# EAGLE design mcb_mini43 (EAGLE 5.11)
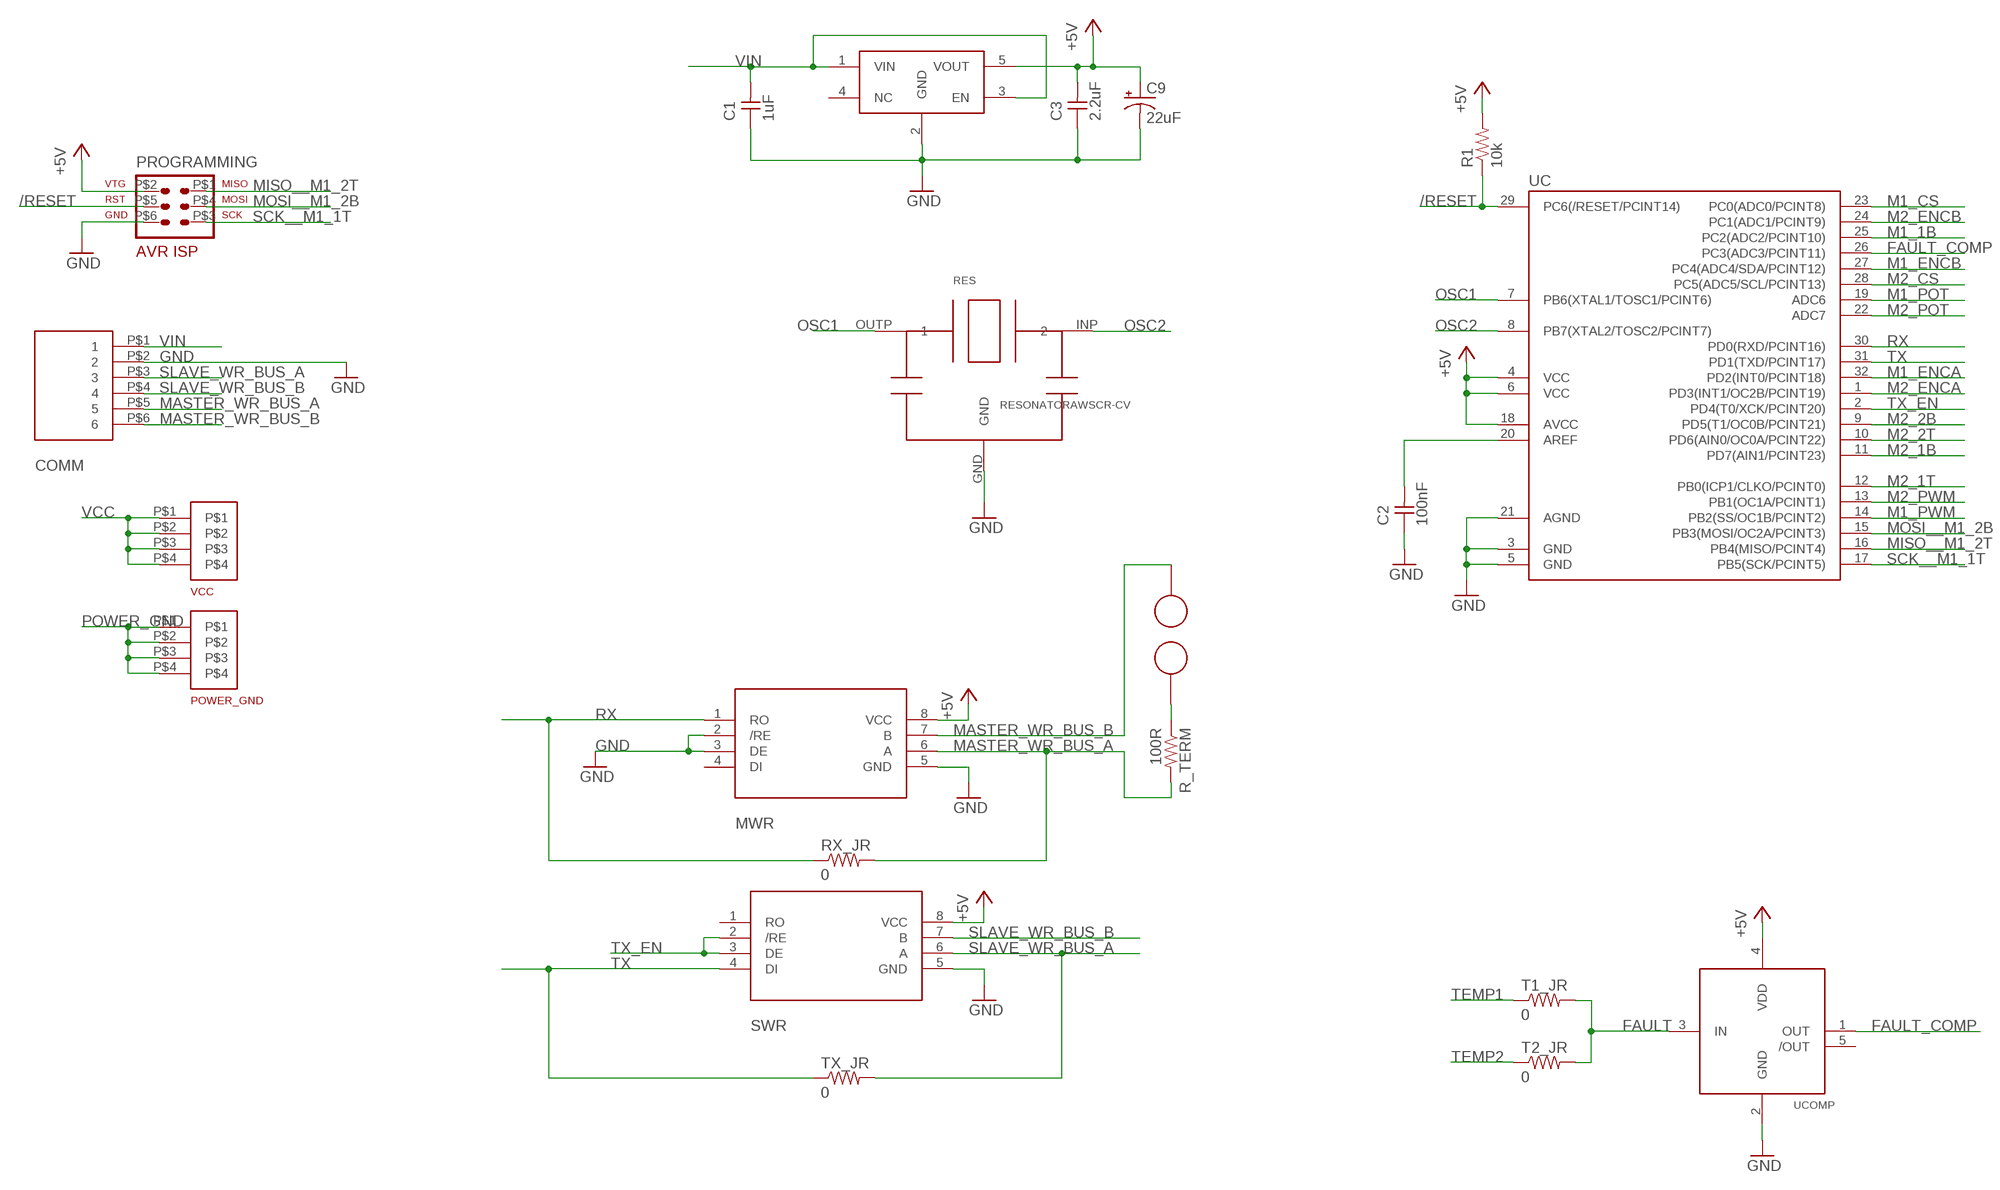
[diagram p0: schematic, sheet 1, part 1 of 2]
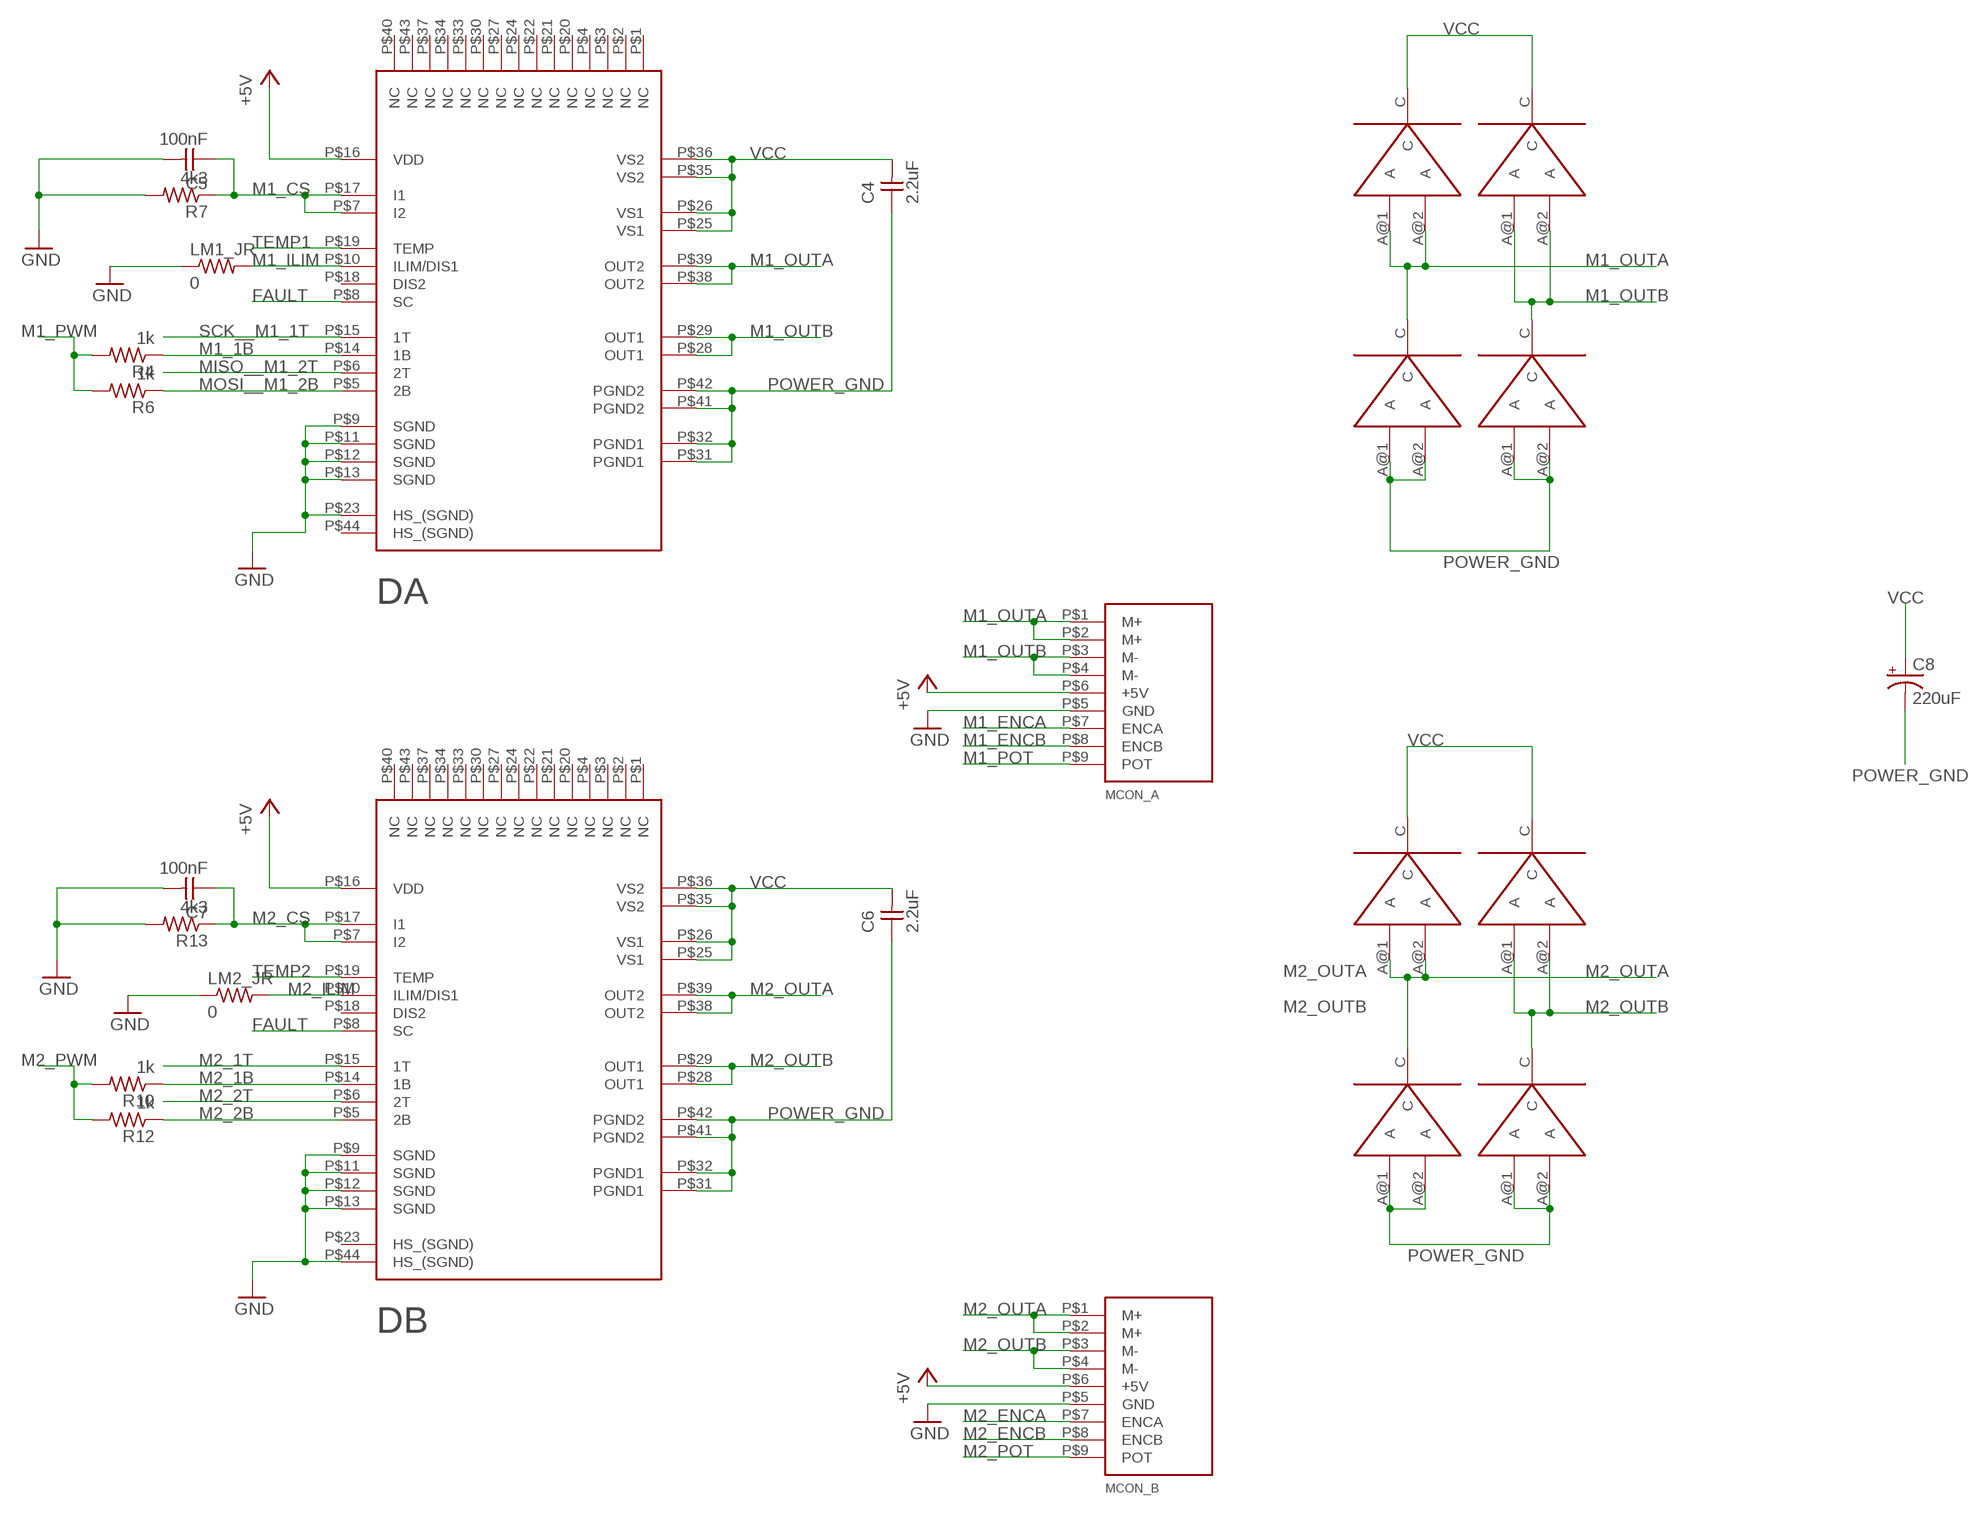
[diagram p1: schematic, sheet 1, part 2 of 2]

## Parts
C1  1uF  CAPACITOR0805  [0805]
C2  100nF  CAPACITOR0805  [0805]
C3  2.2uF  CAPACITOR0805  [0805]
C4  2.2uF  CAPACITOR0805  [0805]
C5  100nF  CAPACITOR0805  [0805]
C6  2.2uF  CAPACITOR0805  [0805]
C7  100nF  CAPACITOR0805  [0805]
C8  220uF  ASM-AXIAL-CAP  [ASM_AXIAL_CAP]
C9  22uF  CAPACITOR-POL-VS  [CAP-POLAR-VS]
COMM  6PIN-RIBBONCABLE-BOARDHEADER  [6PIN-HEADER-DUALROW]
D1  DIODE-POWERMITE  [POWERMITE3]
D2  DIODE-POWERMITE  [POWERMITE3]
D3  DIODE-POWERMITE  [POWERMITE3]
D4  DIODE-POWERMITE  [POWERMITE3]
D5  DIODE-POWERMITE  [POWERMITE3]
D6  DIODE-POWERMITE  [POWERMITE3]
D7  DIODE-POWERMITE  [POWERMITE3]
D8  DIODE-POWERMITE  [POWERMITE3]
DA  APEX-SAS5A757A  [44-HSOP]
DB  APEX-SAS5A757A  [44-HSOP]
LM1_JR  0  RESISTOR0603  [0603]
LM2_JR  0  RESISTOR0603  [0603]
MCON_A  9-PIN-MOTOR_CONNECTOR  [9-PIN-2.54MM-TERMINAL-BLOCK]
MCON_B  9-PIN-MOTOR_CONNECTOR  [9-PIN-2.54MM-TERMINAL-BLOCK]
MWR  ADM4857ARZ  [SOIC8]
POWER_GND  SCREW_TERMINAL_7700K  [SCREW_TERM_7700K]
PROGRAMMING  AVR-ISP-6SURFACE_MOUNT  [SMD6]
R1  10k  RESISTOR0603  [0603]
R4  1k  RESISTOR0603  [0603]
R6  1k  RESISTOR0603  [0603]
R7  4k3  RESISTOR0603  [0603]
R10  1k  RESISTOR0603  [0603]
R12  1k  RESISTOR0603  [0603]
R13  4k3  RESISTOR0603  [0603]
R_TERM  100R  RESISTOR0805  [0805]
RES  RESONATORAWSCR-CV  [AWSCR-CV]
RTERM1  CONNECTOR_TV  [CONNECTOR_TV]
RTERM2  CONNECTOR_TV  [CONNECTOR_TV]
RX_JR  0  RESISTOR0603  [0603]
SWR  ADM4857ARZ  [SOIC8]
T1_JR  0  RESISTOR0603  [0603]
T2_JR  0  RESISTOR0603  [0603]
TX_JR  0  RESISTOR0603  [0603]
UC  MEGA48/88/168-AU  [TQFP32-08]
UCOMP  ADCMP361  [SOT-23-5]
VCC  SCREW_TERMINAL_7700K  [SCREW_TERM_7700K]
VREG  MIC5235  [SOT-23-5]

## Nets
+1.1V: C2.2 UC.20(AREF)
+5V: C3.2 C9.+ DA.P$16(VDD) DB.P$16(VDD) MCON_A.P$6(+5V) MCON_B.P$6(+5V) MWR.8(VCC) PROGRAMMING.P$2 R1.2 SWR.8(VCC) UC.4(VCC) UC.6(VCC) UC.18(AVCC) UCOMP.4(VDD) VREG.5(VOUT)
/RESET: PROGRAMMING.P$5 R1.1 UC.29(PC6(/RESET/PCINT14))
FAULT: DA.P$8(SC) DB.P$8(SC) T1_JR.2 T2_JR.2 UCOMP.3(IN)
FAULT_COMP: UC.26(PC3(ADC3/PCINT11)) UCOMP.1(OUT)
GND: C1.1 C2.1 C3.1 C5.2 C7.2 C9.- COMM.P$2 DA.P$9(SGND) DA.P$11(SGND) DA.P$12(SGND) DA.P$13(SGND) DA.P$23(HS_(SGND)) DB.P$9(SGND) DB.P$11(SGND) DB.P$12(SGND) DB.P$13(SGND) DB.P$44(HS_(SGND)) LM1_JR.1 LM2_JR.1 MCON_A.P$5(GND) MCON_B.P$5(GND) MWR.2(/RE) MWR.3(DE) MWR.5(GND) PROGRAMMING.P$6 R7.2 R13.2 RES.GND SWR.5(GND) UC.3(GND) UC.5(GND) UC.21(AGND) UCOMP.2(GND) VREG.2(GND)
M1_1B: DA.P$14(1B) R4.1 UC.25(PC2(ADC2/PCINT10))
M1_CS: C5.1 DA.P$7(I2) DA.P$17(I1) R7.1 UC.23(PC0(ADC0/PCINT8))
M1_ENCA: MCON_A.P$7(ENCA) UC.32(PD2(INT0/PCINT18))
M1_ENCB: MCON_A.P$8(ENCB) UC.27(PC4(ADC4/SDA/PCINT12))
M1_ILIM: DA.P$10(ILIM/DIS1) LM1_JR.2
M1_OUTA: D1.A@1(A) D1.A@2(A) D3.C DA.P$38(OUT2) DA.P$39(OUT2) MCON_A.P$1(M+) MCON_A.P$2(M+)
M1_OUTB: D2.A@1(A) D2.A@2(A) D4.C DA.P$28(OUT1) DA.P$29(OUT1) MCON_A.P$3(M-) MCON_A.P$4(M-)
M1_POT: MCON_A.P$9(POT) UC.19(ADC6)
M1_PWM: R4.2 R6.2 UC.14(PB2(SS/OC1B/PCINT2))
M2_1B: DB.P$14(1B) R10.1 UC.11(PD7(AIN1/PCINT23))
M2_1T: DB.P$15(1T) UC.12(PB0(ICP1/CLKO/PCINT0))
M2_2B: DB.P$5(2B) R12.1 UC.9(PD5(T1/OC0B/PCINT21))
M2_2T: DB.P$6(2T) UC.10(PD6(AIN0/OC0A/PCINT22))
M2_CS: C7.1 DB.P$7(I2) DB.P$17(I1) R13.1 UC.28(PC5(ADC5/SCL/PCINT13))
M2_ENCA: MCON_B.P$7(ENCA) UC.1(PD3(INT1/OC2B/PCINT19))
M2_ENCB: MCON_B.P$8(ENCB) UC.24(PC1(ADC1/PCINT9))
M2_ILIM: DB.P$10(ILIM/DIS1) LM2_JR.2
M2_OUTA: D5.A@1(A) D5.A@2(A) D7.C DB.P$38(OUT2) DB.P$39(OUT2) MCON_B.P$1(M+) MCON_B.P$2(M+)
M2_OUTB: D6.A@1(A) D6.A@2(A) D8.C DB.P$28(OUT1) DB.P$29(OUT1) MCON_B.P$3(M-) MCON_B.P$4(M-)
M2_POT: MCON_B.P$9(POT) UC.22(ADC7)
M2_PWM: R10.2 R12.2 UC.13(PB1(OC1A/PCINT1))
MASTER_WR_BUS_A: COMM.P$5 MWR.6(A) R_TERM.2 RX_JR.2
MASTER_WR_BUS_B: COMM.P$6 MWR.7(B) RTERM1.P$1
MISO__M1_2T: DA.P$6(2T) PROGRAMMING.P$1 UC.16(PB4(MISO/PCINT4))
MOSI__M1_2B: DA.P$5(2B) PROGRAMMING.P$4 R6.1 UC.15(PB3(MOSI/OC2A/PCINT3))
N$1: R_TERM.1 RTERM2.P$1
OSC1: RES.OUTP UC.7(PB6(XTAL1/TOSC1/PCINT6))
OSC2: RES.INP UC.8(PB7(XTAL2/TOSC2/PCINT7))
POWER_GND: C4.1 C6.1 C8.- D3.A@1(A) D3.A@2(A) D4.A@1(A) D4.A@2(A) D7.A@1(A) D7.A@2(A) D8.A@1(A) D8.A@2(A) DA.P$31(PGND1) DA.P$32(PGND1) DA.P$41(PGND2) DA.P$42(PGND2) DB.P$31(PGND1) DB.P$32(PGND1) DB.P$41(PGND2) DB.P$42(PGND2) POWER_GND.P$1 POWER_GND.P$2 POWER_GND.P$3 POWER_GND.P$4
RX: MWR.1(RO) RX_JR.1 UC.30(PD0(RXD/PCINT16))
SCK__M1_1T: DA.P$15(1T) PROGRAMMING.P$3 UC.17(PB5(SCK/PCINT5))
SLAVE_WR_BUS_A: COMM.P$3 SWR.6(A) TX_JR.2
SLAVE_WR_BUS_B: COMM.P$4 SWR.7(B)
TEMP1: DA.P$19(TEMP) T1_JR.1
TEMP2: DB.P$19(TEMP) T2_JR.1
TX: SWR.4(DI) TX_JR.1 UC.31(PD1(TXD/PCINT17))
TX_EN: SWR.2(/RE) SWR.3(DE) UC.2(PD4(T0/XCK/PCINT20))
VCC: C4.2 C6.2 C8.+ D1.C D2.C D5.C D6.C DA.P$25(VS1) DA.P$26(VS1) DA.P$35(VS2) DA.P$36(VS2) DB.P$25(VS1) DB.P$26(VS1) DB.P$35(VS2) DB.P$36(VS2) VCC.P$1 VCC.P$2 VCC.P$3 VCC.P$4
VIN: C1.2 COMM.P$1 VREG.1(VIN) VREG.3(EN)
Unconnected: DA.P$1(NC) DA.P$2(NC) DA.P$3(NC) DA.P$4(NC) DA.P$18(DIS2) DA.P$20(NC) DA.P$21(NC) DA.P$22(NC) DA.P$24(NC) DA.P$27(NC) DA.P$30(NC) DA.P$33(NC) DA.P$34(NC) DA.P$37(NC) DA.P$40(NC) DA.P$43(NC) DA.P$44(HS_(SGND)) DB.P$1(NC) DB.P$2(NC) DB.P$3(NC) DB.P$4(NC) DB.P$18(DIS2) DB.P$20(NC) DB.P$21(NC) DB.P$22(NC) DB.P$23(HS_(SGND)) DB.P$24(NC) DB.P$27(NC) DB.P$30(NC) DB.P$33(NC) DB.P$34(NC) DB.P$37(NC) DB.P$40(NC) DB.P$43(NC) MWR.4(DI) SWR.1(RO) UCOMP.5(/OUT) VREG.4(NC)

## Library data of the parts
C1-C7 = huggable:CAPACITOR
C8 = soa:ASM-AXIAL-CAP
C9 = soa:CAPACITOR-POL-VS
COMM = soa:6PIN-RIBBONCABLE-BOARDHEADER
D1-D8 = soa:DIODE-POWERMITE
DA DB = soa:APEX-SAS5A757A
LM1_JR LM2_JR R1 R4 R6 R7 R10 R12 R13 R_TERM RX_JR T1_JR T2_JR TX_JR = huggable:RESISTOR
MCON_A MCON_B = soa:9-PIN-MOTOR_CONNECTOR
MWR SWR = soa:ADM4857ARZ
POWER_GND VCC = soa:SCREW_TERMINAL_7700K
PROGRAMMING = avr-4:AVR-ISP-6: AVR ISP-6 Serial Programming Header
RES = soa:RESONATOR
RTERM1 RTERM2 = soa:CONNECTOR_TV
UC = avr-4:MEGA48/88/168
UCOMP = soa:ADCMP361
VREG = soa:MIC5235

## Board
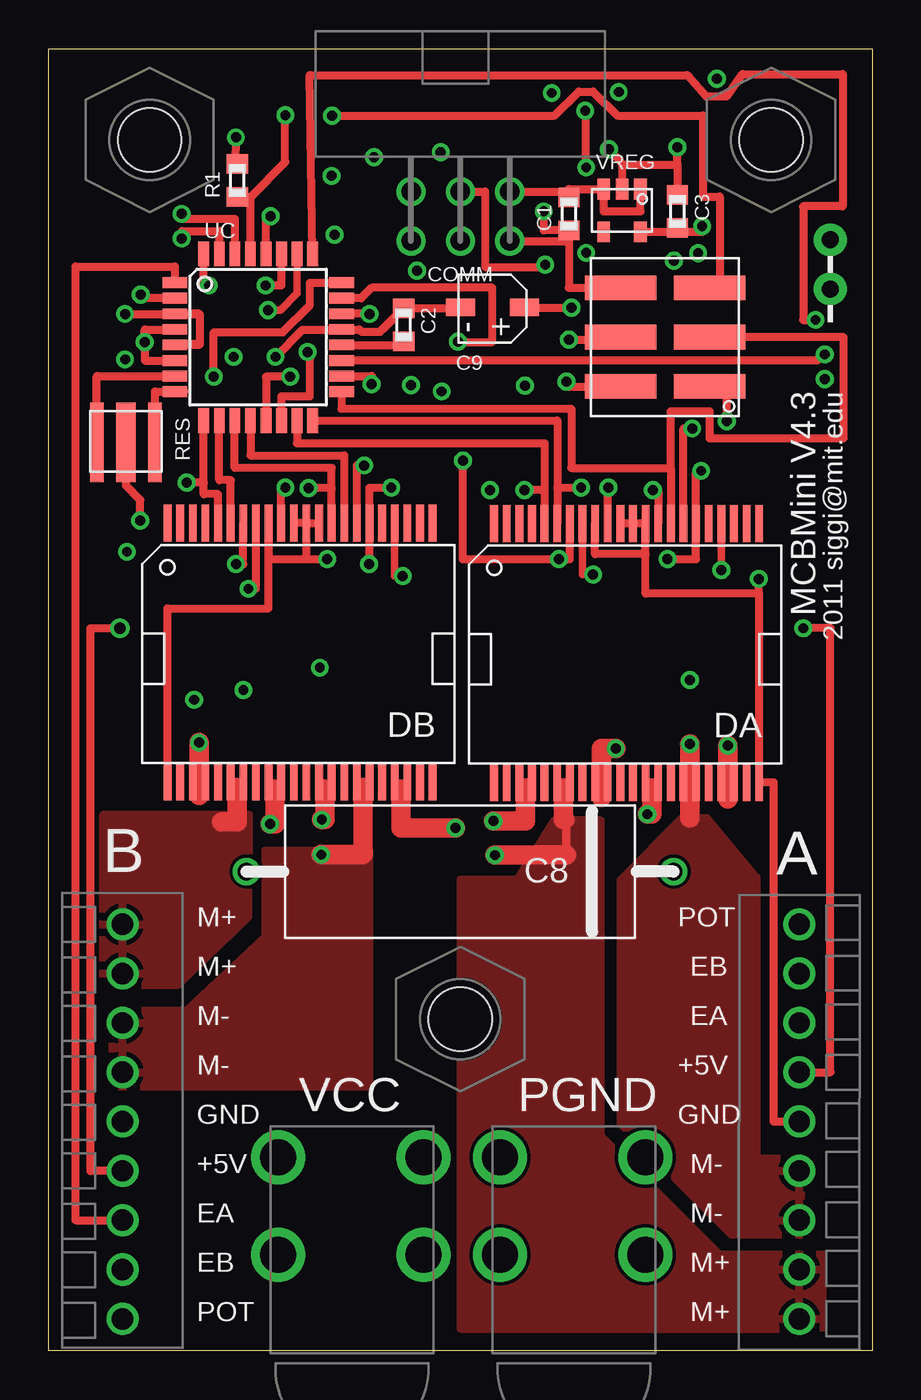
[diagram p2: board, top side]
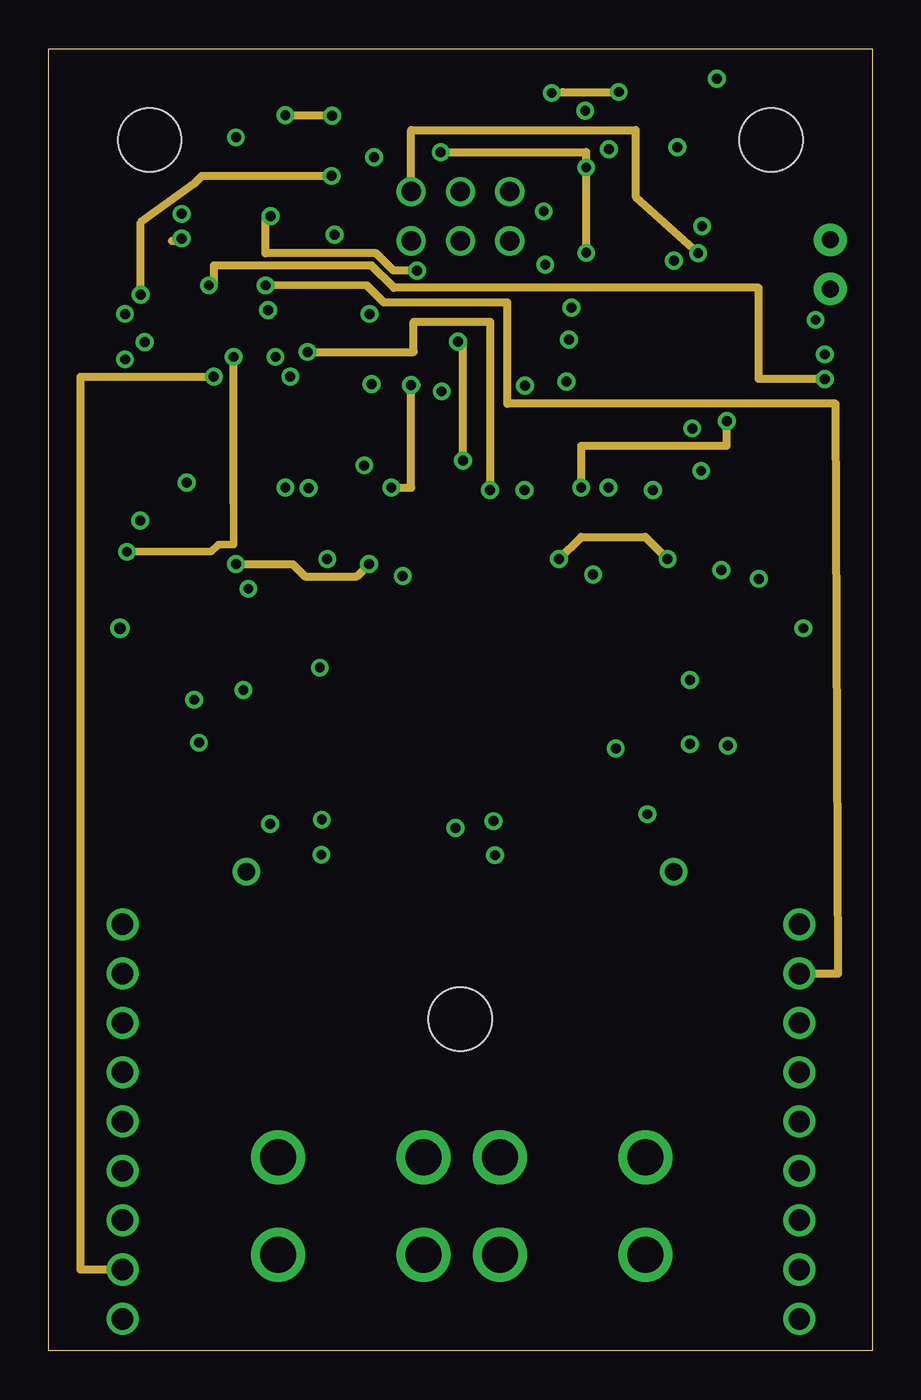
[diagram p3: board, inner layer SIGNAL]
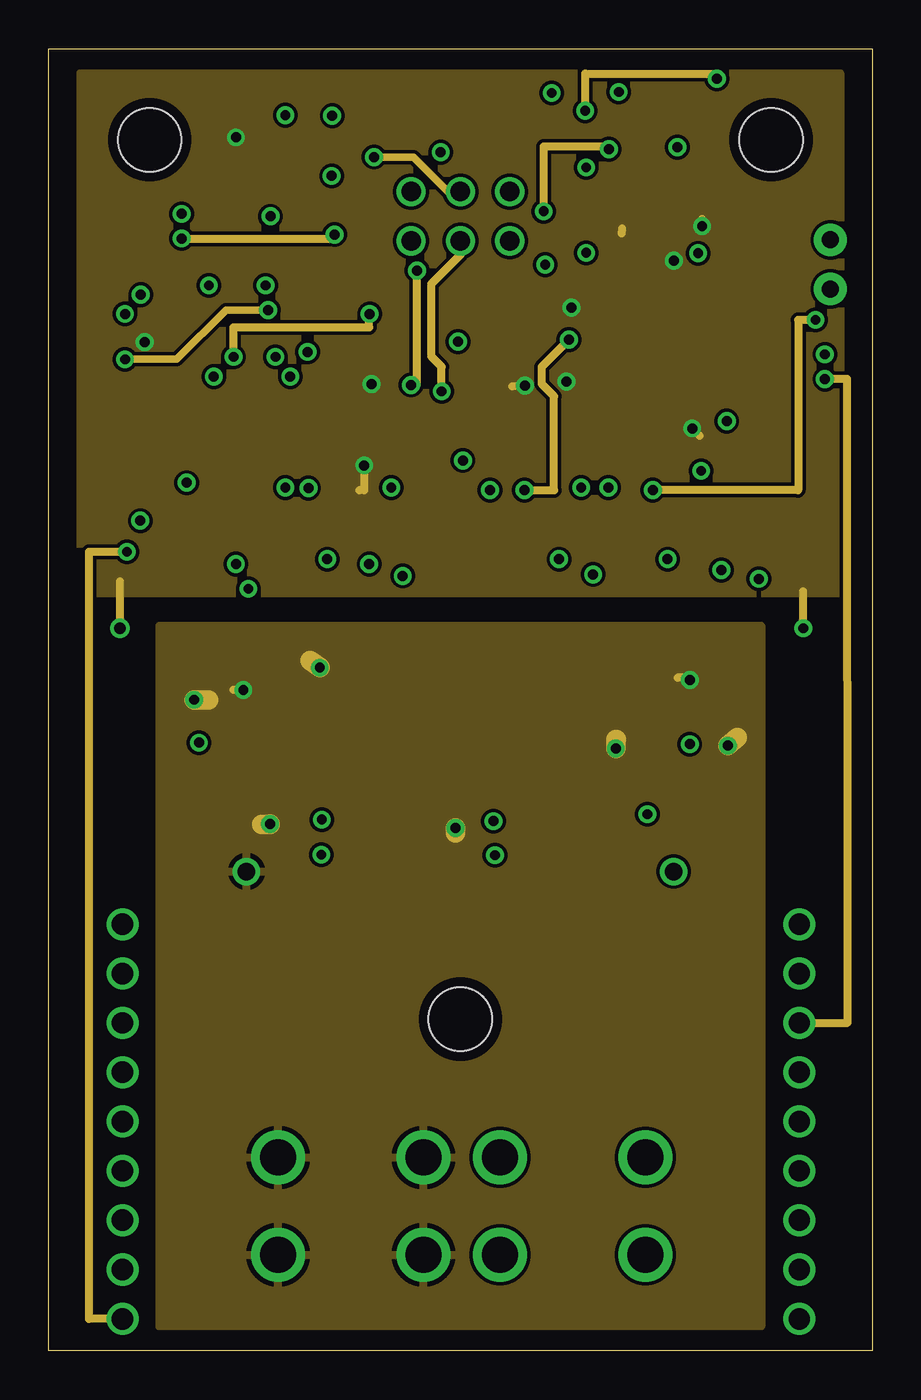
[diagram p4: board, inner layer VCC]
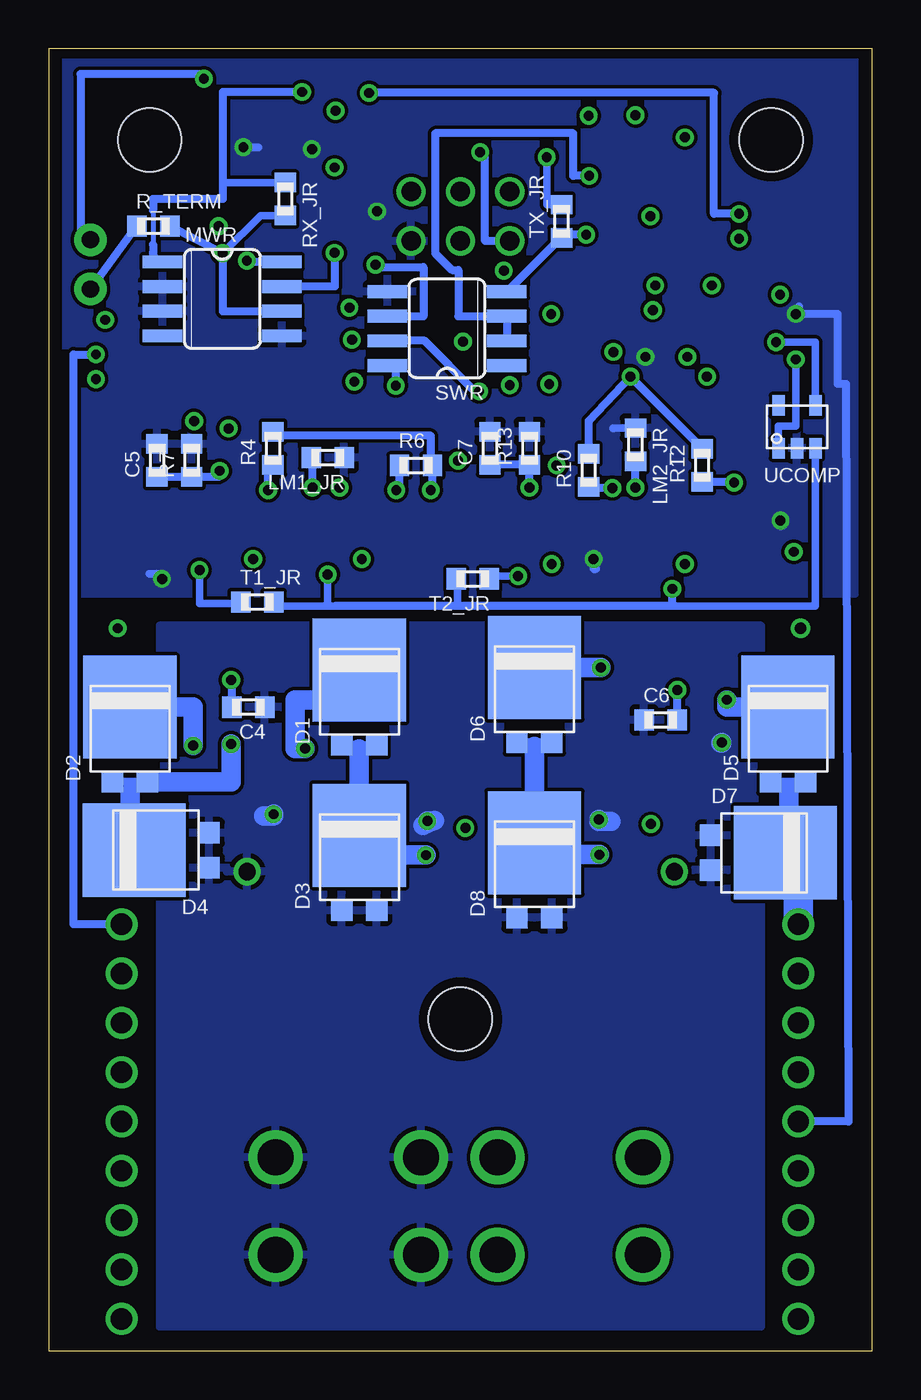
[diagram p5: board, bottom side, seen from below]

Size 42.42 x 67.06 mm. Coordinates in mm from the lower left corner, seen from the top.
Outline: 0,67.06 42.42,67.06 42.42,0 0,0 0,67.06
Copper layers (1*2+3*16): SIGNAL_TOP 0.0356mm / dielectric 1.5011mm / SIGNAL 0.0356mm / dielectric 0.1499mm / VCC 0.0356mm / dielectric 0.2007mm / GND 0.0356mm
Design rules "SilverCircuits_DesignRules *": minimum track width 7mil, minimum drill 14mil, track to track 7mil, track to pad 7mil, pad to pad 7mil, via to via 7mil, smd to smd 0mil, copper to edge 20mil, drill to drill 8mil, minimum pad ring 10mil, minimum via ring 8mil, stop-mask expansion 4mil, vias tented up to drill 0mil, thermal gap 10mil

### Footprints (pad centres in the part's own frame; a part is rotated, then mirrored left to right if it is on the bottom)
0805 = smd 1 x 1.1: 1 -0.85,0; 2 0.85,0
ASM_AXIAL_CAP = drill 0.889 round: + 22,0; - 0,0
CAP-POLAR-VS = smd 0.9 x 1.5: + 0,0; - 0,3.3
6PIN-HEADER-DUALROW = drill 1 round: P$1 -2.54,0; P$2 -2.54,2.54; P$3 0,0; P$4 0,2.54; P$5 2.54,0; P$6 2.54,2.54
POWERMITE3 = smd 1.1 x 1.1: A@1 -0.9,-3.85; A@2 0.9,-3.85 | smd 4.8 x 5.3: C 0,0
44-HSOP = smd 0.4 x 1.9: P$1 6.825,-8.287; P$2 6.175,-8.287; P$3 5.525,-8.287; P$4 4.875,-8.287; P$5 4.225,-8.287; P$6 3.575,-8.287; P$7 2.925,-8.287; P$8 2.275,-8.287; P$9 1.625,-8.287; P$10 0.975,-8.287; P$11 0.325,-8.287; P$12 -0.325,-8.287; P$13 -0.975,-8.287; P$14 -1.625,-8.287; P$15 -2.275,-8.287; P$16 -2.925,-8.287; P$17 -3.575,-8.287; P$18 -4.225,-8.287; P$19 -4.875,-8.287; P$20 -5.525,-8.287; P$21 -6.175,-8.287; P$22 -6.825,-8.287; P$23 -6.825,5.037; P$24 -6.175,5.037; P$25 -5.525,5.037; P$26 -4.875,5.037; P$27 -4.225,5.037; P$28 -3.575,5.037; P$29 -2.925,5.037; P$30 -2.275,5.037; P$31 -1.625,5.037; P$32 -0.975,5.037; P$33 -0.325,5.037; P$34 0.325,5.037; P$35 0.975,5.037; P$36 1.625,5.037; P$37 2.275,5.037; P$38 2.925,5.037; P$39 3.575,5.037; P$40 4.225,5.037; P$41 4.875,5.037; P$42 5.525,5.037; P$43 6.175,5.037; P$44 6.825,5.037
0603 = smd 1 x 1.1: 1 -0.85,0; 2 0.85,0
9-PIN-2.54MM-TERMINAL-BLOCK = drill 1.1 round: P$1 0,0; P$2 2.54,0; P$3 5.08,0; P$4 7.62,0; P$5 10.16,0; P$6 12.7,0; P$7 15.24,0; P$8 17.78,0; P$9 20.32,0
SOIC8 = smd 0.66 x 2.032: 1 -2.477,-2.769; 2 -1.206,-2.769; 3 0.064,-2.769; 4 1.333,-2.769; 5 1.333,3.378; 6 0.064,3.378; 7 -1.206,3.378; 8 -2.477,3.378
SCREW_TERM_7700K = drill 1.854 round: P$1 -3.81,2.032; P$2 3.683,2.032; P$3 -3.81,-2.972; P$4 3.683,-2.972
SMD6 = smd 3.68 x 1.27: P$1 -2.286,2.54; P$2 2.286,2.54; P$3 -2.286,0; P$4 2.286,0; P$5 -2.286,-2.54; P$6 2.286,-2.54
AWSCR-CV = smd 1 x 4.1: GND 0,0 | smd 0.7 x 4.1: INP -1.5,0; OUTP 1.5,0
CONNECTOR_TV = drill 0.889 pad 1.676 round: P$1 0,0
4-40_NUT_DRILL = hole 3.264: 0,0
TQFP32-08 = smd 1.27 x 0.559: 1 -4.293,2.8; 2 -4.293,2; 3 -4.293,1.2; 4 -4.293,0.4; 5 -4.293,-0.4; 6 -4.293,-1.2; 7 -4.293,-2; 8 -4.293,-2.8; 17 4.293,-2.8; 18 4.293,-2; 19 4.293,-1.2; 20 4.293,-0.4; 21 4.293,0.4; 22 4.293,1.2; 23 4.293,2; 24 4.293,2.8 | smd 0.559 x 1.27: 9 -2.8,-4.293; 10 -2,-4.293; 11 -1.2,-4.293; 12 -0.4,-4.293; 13 0.4,-4.293; 14 1.2,-4.293; 15 2,-4.293; 16 2.8,-4.293; 25 2.8,4.293; 26 2,4.293; 27 1.2,4.293; 28 0.4,4.293; 29 -0.4,4.293; 30 -1.2,4.293; 31 -2,4.293; 32 -2.8,4.293
SOT-23-5 = smd 0.65 x 1.06: 1 0,0; 2 0.95,0; 3 1.9,0; 4 1.9,2.2; 5 0,2.2

### Placement (x,y rotation side)
C1  26.8,58.55 90 top
C2  18.29,52.83 270 top
C3  32.39,58.67 270 top
C4  32.13,33.15 180 bottom
C5  36.83,45.85 90 bottom
C6  10.9,32.49 0 bottom
C7  19.68,46.48 90 bottom
C8  32.19,24.68 180 top
C9  24.51,53.72 90 top
COMM  21.21,59.69 180 top
D1  26.42,35.05 0 bottom
D2  38.23,33.15 0 bottom
D3  26.42,26.54 0 bottom
D4  38,25.78 90 bottom
D5  4.34,33.15 0 bottom
D6  17.4,35.18 0 bottom
D7  4.47,25.65 270 bottom
D8  17.4,26.16 0 bottom
DA  29.77,34.32 180 top
DB  12.95,34.34 180 top
LM1_JR  28.04,46 180 bottom
LM2_JR  12.19,46.66 270 bottom
MCON_A  38.66,1.65 90 top
MCON_B  3.81,21.97 270 top
MWR  33.78,53.59 270 bottom
POWER_GND  26.92,6.98 180 top
PROGRAMMING  31.75,52.2 180 top
R1  9.72,60.26 90 top
R4  30.86,46.48 90 bottom
R6  23.5,45.59 0 bottom
R7  35.05,45.85 90 bottom
R10  14.61,45.34 90 bottom
R12  8.76,45.59 90 bottom
R13  17.65,46.48 90 bottom
R_TERM  37.02,57.91 0 bottom
RES  3.99,46.79 180 top
RTERM1  40.26,57.21 270 top
RTERM2  40.26,54.67 270 top
RX_JR  30.23,59.31 270 bottom
SWR  21.59,53.21 90 bottom
T1_JR  31.67,38.56 0 bottom
T2_JR  20.57,39.75 180 bottom
TX_JR  16,58.17 90 bottom
U$3  [4-40_NUT_DRILL]  21.21,17.09 0 top
U$10  [4-40_NUT_DRILL]  5.21,62.36 0 top
U$14  [4-40_NUT_DRILL]  37.21,62.36 0 top
UC  10.8,52.2 0 top
UCOMP  4.83,46.48 0 bottom
VCC  15.49,6.98 180 top
VREG  30.48,59.82 180 top

### Tracks (layer width: path | path; a pad name or v marks a point on that pad's centre or on a via)
+1.1V
  SIGNAL_TOP 0.406: UC.20 18.29,51.8 C2.2
+5V  (via drill 0.51, 0.6)
  SIGNAL_TOP 0.406: DB.P$16 15.88,45.59 v16.26,45.59 | DA.P$16 32.69,47.5 v33.15,47.5 | UC.6 4.95,51 v4.95,51.94 4.95,52.6 UC.4 | UC.18 16.64,50.2 v16.64,49.78 | R1.2 9.63,61.11 v9.65,62.48 | 32.39,57.62 C3.2 | VREG.5 32.39,57.62 | PROGRAMMING.P$2 26.67,49.66 v26.67,49.91 | C9.+ v26.92,53.72 | 32.39,57.62 33.66,57.62 v33.66,57.91 | MCON_A.P$6 40.26,14.35 40.26,37.21 v38.86,37.21 | MCON_B.P$6 2.16,9.27 2.16,37.21 v3.68,37.21
  VCC 0.406: v16.26,45.59 16.26,44.32 16,44.32 | v33.15,47.5 33.53,47.12 | v4.95,51.94 4.95,52.2 | v16.64,49.78 16.64,49.66 | v9.65,62.48 9.65,62.74 | v26.67,49.91 26.67,50.04 | v26.92,53.72 26.67,53.72 | v33.66,57.91 33.66,58.29 | v24.54,49.71 23.88,49.66 | 29.51,57.53 29.54,57.78 | v38.86,37.21 38.86,39.12 | v3.68,37.21 3.68,39.62
  GND 0.381: UCOMP.4 2.93,51.94 v4.95,51.94
  GND 0.406: SWR.8 24.54,50.74 v24.54,49.71 | MWR.8 32.21,56.07 v32.21,56.13
  pour VCC: 1.65,38.99 1.65,65.79 40.77,65.79 40.77,38.99
/RESET  (via drill 0.51)
  SIGNAL_TOP 0.406: UC.29 10.39,59.41 | 10.39,59.41 R1.1 | 34.57,54.74 PROGRAMMING.P$5 | 34.57,54.74 34.75,54.74 | v12.19,63.63 12.19,61.21 10.39,59.41 | v14.61,63.6 26.06,63.6 27.31,64.85 28.04,64.85 29.29,63.6 33.71,63.6 33.71,59.44 34.57,59.44 34.57,54.74
  SIGNAL 0.406: v14.61,63.6 14.61,63.63 v12.19,63.63
FAULT  (via drill 0.51)
  SIGNAL_TOP 0.381: DA.P$8 27.48,42.6 27.48,39.98 v28.04,39.98
  SIGNAL_TOP 0.406: DB.P$8 10.68,39.24 v10.29,39.24
  GND 0.381: T2_JR.2 21.36,39.75 21.36,38.35 | 28.04,38.35 30.82,38.35 T1_JR.2 | UCOMP.3 2.92,38.35 10.29,38.35 | 27.64,38.35 28.04,38.35 | 28.04,38.35 v28.04,39.98
  GND 0.406: 10.16,39.24 v10.29,39.24 10.29,38.35 21.36,38.35 27.64,38.35
FAULT_COMP  (via drill 0.51)
  SIGNAL_TOP 0.381: UC.26 12.8,54.45 11.94,53.59 v11.3,53.59
  VCC 0.381: v3.94,51.05 6.6,51.05 9.14,53.59 v11.3,53.59
  GND 0.381: UCOMP.1 4.83,47.62 3.94,47.62 v3.94,51.05
GND  (via drill 0.51)
  SIGNAL_TOP 0.406: DB.P$44 6.13,38.23 11.33,38.23 DB.P$9 11.33,40.77 13.28,40.77 | DA.P$23 36.59,38.99 36.58,38.99 | 36.58,38.99 30.74,38.99 30.74,41.02 | 30.74,41.02 DA.P$13 DA.P$12 DA.P$11 | DB.P$12 DB.P$11 | DB.P$12 DB.P$13 | 13.28,40.77 DB.P$12 | 13.28,40.77 v14.35,40.77 | DA.P$9 28.14,41.02 30.74,41.02 | 36.58,38.99 v36.58,39.75 | C2.1 17.2,52.6 | v11.68,51.18 13.08,52.58 15.09,52.58 UC.21 16.01,52.6 16.13,52.48 17.08,52.48 C2.1 | 32.39,61.09 C3.1 | 26.8,57.15 C1.1 25.5,57.7 v25.5,58.67 | COMM.P$2 26.8,57.15 | VREG.2 29.53,61.09 29.57,61.09 | 29.57,61.09 32.39,61.09 | 32.39,61.09 v32.39,61.98 | C2.1 21.21,53.68 C9.- | PROGRAMMING.P$6 26.8,54.74 26.8,57.15 | UC.3 7.77,53.4 7.77,53.39 | 7.77,53.39 7.77,51.84 | 7.77,51.84 6.5,51.84 UC.5 7.77,51.8 7.77,51.84 | v3.94,53.39 7.77,53.39 | v28.85,61.87 29.57,61.09 | RES.GND 3.99,44.55 4.72,43.81 v4.72,42.75 | DA.P$23 36.59,29.21 | MCON_A.P$5 37.34,11.81 37.34,29.28 DA.P$23
  VCC 0.406: v25.5,58.67 25.5,62.03 28.88,62.03 28.88,61.82 v28.85,61.87
  GND 0.406: LM2_JR.1 13.34,47.5 | v14.35,40.77 14.35,40.26 14.22,40.26 | v36.58,39.75 36.58,40 37.21,40 | v11.68,51.18 11.68,51.31 | v32.39,61.98 31.62,61.98 | 3.76,53.77 3.76,53.42 v3.94,53.39 1.78,53.39 1.78,49.78 1.35,49.78 1.22,11.81 MCON_B.P$5 | v4.72,42.75 4.72,42.47 4.57,42.52
  pour GND: 0.89,47.88 0.89,66.55 17.78,66.55 41.53,66.55 41.53,47.5 41.53,38.99 2.29,38.99 0.89,38.99
M1_1B  (via drill 0.51)
  SIGNAL_TOP 0.406: DA.P$14 31.39,44.32 v31.11,44.32 | v39.5,53.09 38.86,53.09 38.86,58.93 40.89,58.93 40.89,65.73 35.74,65.73 34.92,64.59 33.86,64.59 32.89,65.68 13.44,65.68 UC.25
  VCC 0.406: v31.11,44.32 38.61,44.32 38.61,53.09 v39.5,53.09
  GND 0.406: v31.11,44.32 31.11,45.63 R4.1
M1_CS  (via drill 0.51)
  SIGNAL_TOP 0.406: v31.88,40.77 33.34,40.77 DA.P$17 33.34,45.26 v33.6,45.31 | DA.P$7 26.84,40.77 v26.29,40.77 21.34,40.77 v21.34,45.85 | UC.23 16.1,54.2 16.64,54.74 22.86,54.74 22.86,51.94 21.08,51.94 v21.08,51.97
  SIGNAL 0.406: v26.29,40.77 27.43,41.91 30.73,41.91 v31.88,40.77 | v21.34,45.85 21.34,51.94 v21.08,51.97
  GND 0.406: v33.6,45.31 33.66,45 R7.1 C5.1
M1_ENCA  (via drill 0.51)
  SIGNAL_TOP 0.406: v8.26,54.86 8,54.86 UC.32
  SIGNAL 0.406: v8.26,54.86 8.51,54.86 8.51,55.88 16.64,55.88 17.78,54.74 36.58,54.74 36.58,50.04 v39.98,50.04
  VCC 0.406: v39.98,50.04 41.12,50.04 41.15,18.92 41.15,16.89 MCON_A.P$7
M1_ENCB  (via drill 0.51)
  SIGNAL_TOP 0.406: v11.18,54.86 12,54.86 UC.27
  SIGNAL 0.381: 16.38,54.86 v11.18,54.86
  SIGNAL 0.406: 16.38,54.86 17.27,53.97 23.62,53.97 23.62,48.77 40.54,48.77 40.67,19.43 MCON_A.P$8
M1_ILIM  (via drill 0.51)
  SIGNAL_TOP 0.406: DA.P$10 28.79,44.45 v28.83,44.45
  GND 0.406: v28.83,44.45 28.83,46 LM1_JR.2
M1_OUTA  (via drill 0.51)
  SIGNAL_TOP 0.406: DA.P$39 DA.P$38 26.52,29.28 26.52,28.45 26.67,28.45 26.67,25.53
  SIGNAL_TOP 1.016: 26.52,28.45 26.52,27.36 26.59,27.36 | v22.99,25.53 26.67,25.53
  GND 0.406: 26.42,31.2 D1.A@2 | 26.42,31.2 D1.A@1 | 26.42,30.99 26.42,31.2
  GND 1.016: 26.42,28.45 26.42,30.99 | 26.42,28.45 25.78,28.45 25.78,27.18 26.54,27.18 26.54,26.54 D3.C | 26.42,28.45 26.42,25.53 v22.99,25.53
  pour SIGNAL_TOP: 39.88,4.95 34.54,4.95 28.45,11.05 28.45,27.3 26.04,27.3 24.13,24.26 21.21,24.26 21.21,1.14 39.88,1.14
M1_OUTB  (via drill 0.51)
  SIGNAL_TOP 0.406: 33.02,29.28 DA.P$29 | 33.02,29.28 DA.P$28 | 33.02,28.45 33.02,29.28 | 33.02,29.28 v33.02,31.24
  SIGNAL_TOP 1.016: 33.02,27.43 33.02,28.45 | v33.02,31.24 33.02,30.1
  GND 0.406: D2.A@1 D2.A@2 38.23,29.3 38.23,28.7 38.23,26.8 36.07,26.8
  GND 1.016: 38.23,28.7 38.23,25.4 D4.C | 36.07,26.8 36.07,27.05 | v33.02,31.24 33.02,29.3 D2.A@2
  pour SIGNAL_TOP: 35.18,5.97 29.46,11.68 29.46,24.26 32.64,27.43 33.91,27.43 36.45,24.38 36.45,9.91 38.73,9.91 38.73,5.97
M1_POT  (via drill 0.51)
  SIGNAL_TOP 0.406: UC.19 39.6,51 v39.98,51.31
  GND 0.381: 41.12,42.29 41.12,42.16
  GND 0.406: v39.98,51.31 41.12,51.31 41.12,42.29 41.12,21.97 MCON_A.P$9
M1_PWM  (via drill 0.51)
  SIGNAL_TOP 0.406: UC.14 12,49.15 13.46,49.15 13.46,51.44 v13.34,51.44
  SIGNAL 0.406: v22.73,44.32 22.73,52.98 18.8,52.98 18.8,51.44 v13.34,51.44
  GND 0.406: v22.73,44.32 22.64,44.2 R6.2 22.73,45.59 22.73,47.12 30.86,47.12 R4.2
M2_1B  (via drill 0.51)
  SIGNAL_TOP 0.406: UC.11 9.6,45.47 14.58,45.47 14.58,44.42 | DB.P$14 14.58,44.42 | 14.58,44.42 v13.39,44.42
  GND 0.406: R10.1 14.61,44.42 v13.39,44.42
M2_1T
  SIGNAL_TOP 0.406: UC.12 10.39,46.1 15.23,46.1 DB.P$15
M2_2B  (via drill 0.51)
  SIGNAL_TOP 0.406: 8,44.7 UC.9 | DB.P$5 8.73,44.11 8,44.11 8,44.7 | 8,44.7 v7.11,44.7
  GND 0.406: v7.11,44.7 7.11,44.74 R12.1
M2_2T
  SIGNAL_TOP 0.406: UC.10 8.79,44.83 9.38,44.83 DB.P$6
M2_CS  (via drill 0.51)
  SIGNAL_TOP 0.406: DB.P$7 10.03,40.51 v9.65,40.51 | v16.51,40.51 16.53,40.51 DB.P$17 16.53,44.45 v17.65,44.45 | UC.28 11.18,56.49 11.18,58.42 v11.43,58.42
  SIGNAL 0.406: v9.65,40.51 12.57,40.51 13.21,39.88 15.88,39.88 v16.51,40.51 | v17.65,44.45 18.67,44.45 v18.67,49.73 18.97,49.73 | v11.43,58.42 11.18,58.42 11.18,56.52 16.87,56.52 17.75,55.63 v18.97,55.63
  VCC 0.406: v18.97,55.63 18.97,49.73 v18.67,49.73
  GND 0.406: v17.65,44.45 R13.1 C7.1
M2_ENCA
  SIGNAL_TOP 0.406: UC.1 6.5,55.83 1.4,55.83 1.4,6.73 MCON_B.P$7
M2_ENCB  (via drill 0.51)
  SIGNAL_TOP 0.406: v8.51,50.16 8.51,52.45 12.07,52.45 13.46,53.85 13.46,55 UC.24
  SIGNAL 0.406: v8.51,50.16 1.65,50.16 1.65,4.19 MCON_B.P$8
M2_ILIM  (via drill 0.51)
  SIGNAL_TOP 0.406: DB.P$10 11.98,44.45 v12.19,44.45
  GND 0.406: v12.19,44.45 LM2_JR.2
M2_OUTA
  SIGNAL_TOP 0.406: DB.P$38 DB.P$39 9.7,29.3 9.7,28.52
  SIGNAL_TOP 1.016: 9.7,28.52 9.7,27.23 8.92,27.23
  GND 0.406: D5.A@2 D5.A@1 3.94,29.3 4.29,28.83
  GND 1.016: 5.65,25.02 D7.C 4.29,25.71 4.29,28.83
  GND 1.524: 5.65,25.02 3.81,25.02 MCON_B.P$1
  pour SIGNAL_TOP: 2.82,18.82 2.82,27.61 10.31,27.61 10.29,22.35 6.63,18.82
M2_OUTB  (via drill 0.51)
  SIGNAL_TOP 0.254: DB.P$28 16.21,29.3 16.21,28.93
  SIGNAL_TOP 0.406: DB.P$28 DB.P$29
  SIGNAL_TOP 1.016: 16.21,28.93 16.21,25.55 v14.05,25.55
  GND 0.406: D6.A@1 D6.A@2 17.27,31.2 17.4,31.11
  GND 1.016: v14.05,25.55 17.4,25.55 D8.C 17.4,31.11
  pour SIGNAL_TOP: 3.3,17.53 7.11,17.53 11.18,21.34 11.18,25.78 16.51,25.78 16.51,13.59 3.3,13.59
M2_POT  (via drill 0.51)
  SIGNAL_TOP 0.406: v16.54,53.39 16.59,53.4 UC.22
  SIGNAL 0.381: 9.53,43.69 9.53,41.53 8.76,41.53 8.38,41.15 v4.04,41.15
  SIGNAL 0.406: 9.53,43.69 v9.53,51.18
  VCC 0.406: v4.04,41.15 2.08,41.15 2.08,1.65 MCON_B.P$9 | v9.53,51.18 9.53,52.7 16.51,52.7 v16.54,53.39
M2_PWM  (via drill 0.51)
  SIGNAL_TOP 0.406: v12.45,50.16 11.2,50.16 UC.13
  GND 0.406: R12.2 8.72,46.44 v12.45,50.16 14.61,47.88 R10.2
MASTER_WR_BUS_A  (via drill 0.51)
  SIGNAL 0.406: COMM.P$5 18.67,62.86 30.23,62.86 30.23,59.44 v33.45,56.52
  GND 0.381: RX_JR.2 31.51,58.46 v33.45,56.52
  GND 0.406: MWR.6 33.45,53.53 v33.45,56.52 R_TERM.2
MASTER_WR_BUS_B  (via drill 0.51)
  SIGNAL_TOP 0.406: v27.64,63.86 27.69,63.96 v27.69,60.94
  SIGNAL 0.406: v20.19,61.72 27.69,61.72 v27.69,60.94 v27.69,56.54
  VCC 0.406: v27.64,63.86 27.64,65.76 34.42,65.76 v34.42,65.51
  GND 0.406: COMM.P$6 19.94,57.15 19.94,61.72 v20.19,61.72 | v27.69,56.54 27.69,54.8 MWR.7 | RTERM1.P$1 40.77,57.21 40.77,65.73 34.42,65.73 v34.42,65.51
MISO__M1_2T  (via drill 0.51)
  SIGNAL_TOP 0.406: UC.16 26.19,47.9 26.19,44.45 | 26.19,44.45 DA.P$6 | 26.19,44.45 v27.43,44.45 | v34.92,47.88 34.92,49.66 PROGRAMMING.P$1
  SIGNAL 0.406: v27.43,44.45 27.43,46.61 34.92,46.61 v34.92,47.88
MOSI__M1_2B  (via drill 0.51)
  SIGNAL_TOP 0.406: UC.15 12.8,46.74 25.54,46.74 25.54,44.32 | 25.54,44.32 DA.P$5 | 25.54,44.32 v24.51,44.32 | PROGRAMMING.P$4 29.46,52.07 v26.8,52.07
  VCC 0.406: v24.51,44.32 26.04,44.32 26.04,49.15 25.4,49.78 25.4,50.67 v26.8,52.07
  GND 0.406: R6.1 24.34,44.32 v24.51,44.32
N$1
  GND 0.406: R_TERM.1 RTERM2.P$1
OSC1
  SIGNAL_TOP 0.406: 6.5,50.16 UC.7 2.49,50.2 RES.OUTP
OSC2
  SIGNAL_TOP 0.406: 6.98,49.4 UC.8 5.49,49.4 RES.INP
POWER_GND  (via drill 0.51)
  SIGNAL_TOP 0.254: DB.P$31 DB.P$32 14.25,29.3 14.25,28.45 | DB.P$42 DB.P$41 8.08,28.6 7.75,28.6
  SIGNAL_TOP 0.406: DA.P$42 DA.P$41 24.56,29.28 24.56,28.42 | DA.P$32 DA.P$31 31.04,29.28 31.06,28.45
  SIGNAL_TOP 1.016: 14.25,28.45 14.25,27.36 v14.07,27.36 | 7.75,28.6 v7.75,31.32 | 24.56,28.42 24.56,27.28 v22.91,27.28 | 31.06,28.45 31.06,27.64 v30.84,27.64
  GND 1.016: v14.07,27.36 14.07,27.25 13.46,27.25 | v7.75,31.32 7.75,31.29 7.8,31.29 | v22.91,27.28 22.53,27.3 23.14,27.05 | v30.84,27.64 30.84,27.53 31.34,27.53
  pour GND: 5.71,1.27 5.71,37.34 35.18,37.34 36.7,37.34 36.7,2.54 36.7,1.27
RX  (via drill 0.51)
  SIGNAL_TOP 0.406: UC.30 9.6,58.29 6.86,58.29 v6.86,58.55
  SIGNAL 0.406: v6.86,58.55 7.11,58.55 | v29.36,64.82 26.47,64.82 v25.91,64.77
  GND 0.254: 37.03,58.72 37.03,56.97
  GND 0.381: 33.45,59.31 33.45,60.16 RX_JR.1
  GND 0.406: MWR.1 arc90 37.03,56.55 37.03,56.97 | 37.03,58.72 37.03,59.31 33.45,59.31 33.45,64.82 v29.36,64.82 | v25.91,64.77 8.15,64.77 8.15,58.55 v6.86,58.55
SCK__M1_1T
  SIGNAL_TOP 0.406: UC.17 15.09,48.51 26.92,48.51 26.92,45.47 32.04,45.47 | 32.04,45.47 DA.P$15 | 32.04,45.47 32.04,48.39 34.04,48.39 34.04,46.99 40.94,46.99 40.94,52.2 PROGRAMMING.P$3
SLAVE_WR_BUS_A  (via drill 0.51)
  SIGNAL_TOP 0.406: COMM.P$3 22.48,59.69 22.48,55.8 25.58,55.8 v25.58,55.93
  VCC 0.381: COMM.P$3 20.57,59.69 18.8,61.47 v16.76,61.47
  GND 0.381: v16.76,61.47 16.76,59.02 TX_JR.2
  GND 0.406: v25.58,55.93 25.58,55.8 23.11,55.8 23.11,53.26 SWR.6
SLAVE_WR_BUS_B  (via drill 0.51)
  VCC 0.406: v20.24,49.4 20.24,50.67 19.71,51.21 19.71,54.94 21.26,56.49 21.26,57.1 COMM.P$4
  GND 0.406: SWR.7 23.05,52.01 20.45,49.4 v20.24,49.4
TEMP1  (via drill 0.51)
  SIGNAL_TOP 0.381: DA.P$19 v34.65,40.21
  GND 0.381: v34.65,40.21 34.65,38.48 32.52,38.48 T1_JR.1
TEMP2  (via drill 0.51)
  SIGNAL_TOP 0.381: DB.P$19 17.83,39.9 v18.24,39.9
  GND 0.381: v18.24,39.9 19.72,39.9 T2_JR.1
TX  (via drill 0.51)
  SIGNAL_TOP 0.406: UC.31 8.79,57.66 6.86,57.66 v6.86,57.28
  SIGNAL 0.406: v6.86,57.28 6.86,57.15 6.35,57.15
  VCC 0.406: v14.73,57.48 14.53,57.28 v6.86,57.28
  GND 0.381: 15.89,57.48 15.89,57.32 TX_JR.1
  GND 0.406: SWR.4 15.89,57.48 v14.73,57.48
TX_EN  (via drill 0.51)
  SIGNAL_TOP 0.406: UC.2 4.78,54.2 4.75,54.2 v4.75,54.38
  SIGNAL 0.406: v4.75,54.38 4.75,58.11 7.49,60.1 7.9,60.5 v14.58,60.5
  GND 0.406: SWR.2 SWR.3 21.31,53.28 21.31,55.65 21.64,55.65 22.5,56.52 22.5,62.69 15.39,62.69 15.39,60.5 v14.58,60.5
VCC  (via drill 0.51)
  SIGNAL_TOP 0.254: DB.P$25 DB.P$26 18.16,29.3 18.16,28.47 | DB.P$35 DB.P$36 11.66,29.3 11.66,28.45
  SIGNAL_TOP 0.406: DA.P$25 DA.P$26 arc-90 34.98,28.95 34.98,28.42 | DA.P$35 DA.P$36 28.47,29.28 28.47,28.5
  SIGNAL_TOP 1.016: 18.16,28.47 18.16,26.92 v20.96,26.92 | 11.66,28.45 11.66,27.13 v11.41,27.13 | 34.98,28.42 v34.98,31.17 | 28.47,28.5 28.47,31.01 v29.21,31.01
  VCC 0.406: v10.03,34.04 9.53,34.04 | v33.02,34.54 33.02,34.67 32.39,34.67
  VCC 1.016: v20.96,26.92 20.96,26.67 | v11.41,27.13 11.41,27.1 10.97,27.1 | v7.49,33.53 8.26,33.53 | v13.97,35.18 13.46,35.56 | v34.98,31.17 35.48,31.57 35.46,31.57 | v29.21,31.01 29.21,31.47 29.24,31.47
  GND 0.406: C6.2 10.05,34.04 v10.03,34.04 | C4.2 32.93,34.54 v33.02,34.54
  GND 1.016: D5.C 7.49,33.15 v7.49,33.53 | v13.97,35.18 D6.C | D1.C 26.42,33.53 29.72,33.53 29.72,31.01 v29.21,31.01 | D2.C 34.98,33.15 v34.98,31.17
  pour VCC: 5.71,1.27 5.71,37.34 19.18,37.34 36.7,37.34 36.7,1.78 36.7,1.27
VIN
  SIGNAL_TOP 0.406: 26.8,59.69 C1.2 | VREG.1 30.48,58.67 28.57,58.67 VREG.3 26.8,59.82 26.8,59.69 | COMM.P$1 26.8,59.69

### Text on the board
_tsilk: MCBMini V4.3 | 2011 siggi@mit.edu | B | A | M+ | POT | M+ | EB | M- | EA | M- | +5V | GND | VCC | PGND | GND | +5V | M- | EA | M- | EB | M+ | POT | M+